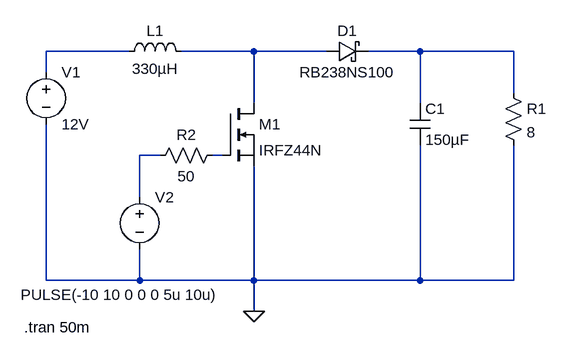
[diagram p0: schematic BoostMOSFET1.asc]
BoostMOSFET1.asc, the LTspice schematic file:
Version 4
SHEET 1 880 680
WIRE 128 112 0 112
WIRE 320 112 208 112
WIRE 432 112 320 112
WIRE 576 112 496 112
WIRE 720 112 576 112
WIRE 0 144 0 112
WIRE 720 176 720 112
WIRE 320 192 320 112
WIRE 576 192 576 112
WIRE 176 272 144 272
WIRE 272 272 256 272
WIRE 144 336 144 272
WIRE 0 464 0 224
WIRE 144 464 144 416
WIRE 144 464 0 464
WIRE 320 464 320 288
WIRE 320 464 144 464
WIRE 576 464 576 256
WIRE 576 464 320 464
WIRE 720 464 720 256
WIRE 720 464 576 464
WIRE 320 512 320 464
FLAG 320 512 0
SYMBOL voltage 0 128 R0
WINDOW 123 0 0 Left 0
WINDOW 39 0 0 Left 0
SYMATTR InstName V1
SYMATTR Value 12V
SYMBOL ind 112 128 R270
WINDOW 0 32 56 VTop 2
WINDOW 3 5 56 VBottom 2
SYMATTR InstName L1
SYMATTR Value 330µH
SYMBOL schottky 432 128 R270
WINDOW 0 32 32 VTop 2
WINDOW 3 0 32 VBottom 2
SYMATTR InstName D1
SYMATTR Value RB238NS100
SYMATTR Description Diode
SYMATTR Type diode
SYMBOL nmos 272 192 R0
SYMATTR InstName M1
SYMATTR Value IRFZ44N
SYMBOL cap 560 192 R0
SYMATTR InstName C1
SYMATTR Value 150µF
SYMBOL res 704 160 R0
SYMATTR InstName R1
SYMATTR Value 8
SYMBOL voltage 144 320 R0
WINDOW 3 -183 166 Left 2
WINDOW 123 0 0 Left 0
WINDOW 39 0 0 Left 0
SYMATTR InstName V2
SYMATTR Value PULSE(-10 10 0 0 0 5u 10u)
SYMBOL res 272 256 R90
WINDOW 0 0 56 VBottom 2
WINDOW 3 32 56 VTop 2
SYMATTR InstName R2
SYMATTR Value 50
TEXT -34 536 Left 2 !.tran 50m

The netlist it stands for:
* BoostMOSFET1.asc
V1 N001 0 12V
L1 N001 N002 330µH
D1 N002 N003 RB238NS100
M1 N002 N005 0 0 IRFZ44N
C1 N003 0 150µF
R1 N003 0 8
V2 N004 0 PULSE(-10 10 0 0 0 5u 10u)
R2 N005 N004 50
.model D D
.lib standard.dio
.model NMOS NMOS
.model PMOS PMOS
.lib standard.mos
.tran 50m
.backanno
.end